# EAGLE design adrone_v0 (EAGLE 8.1.0)
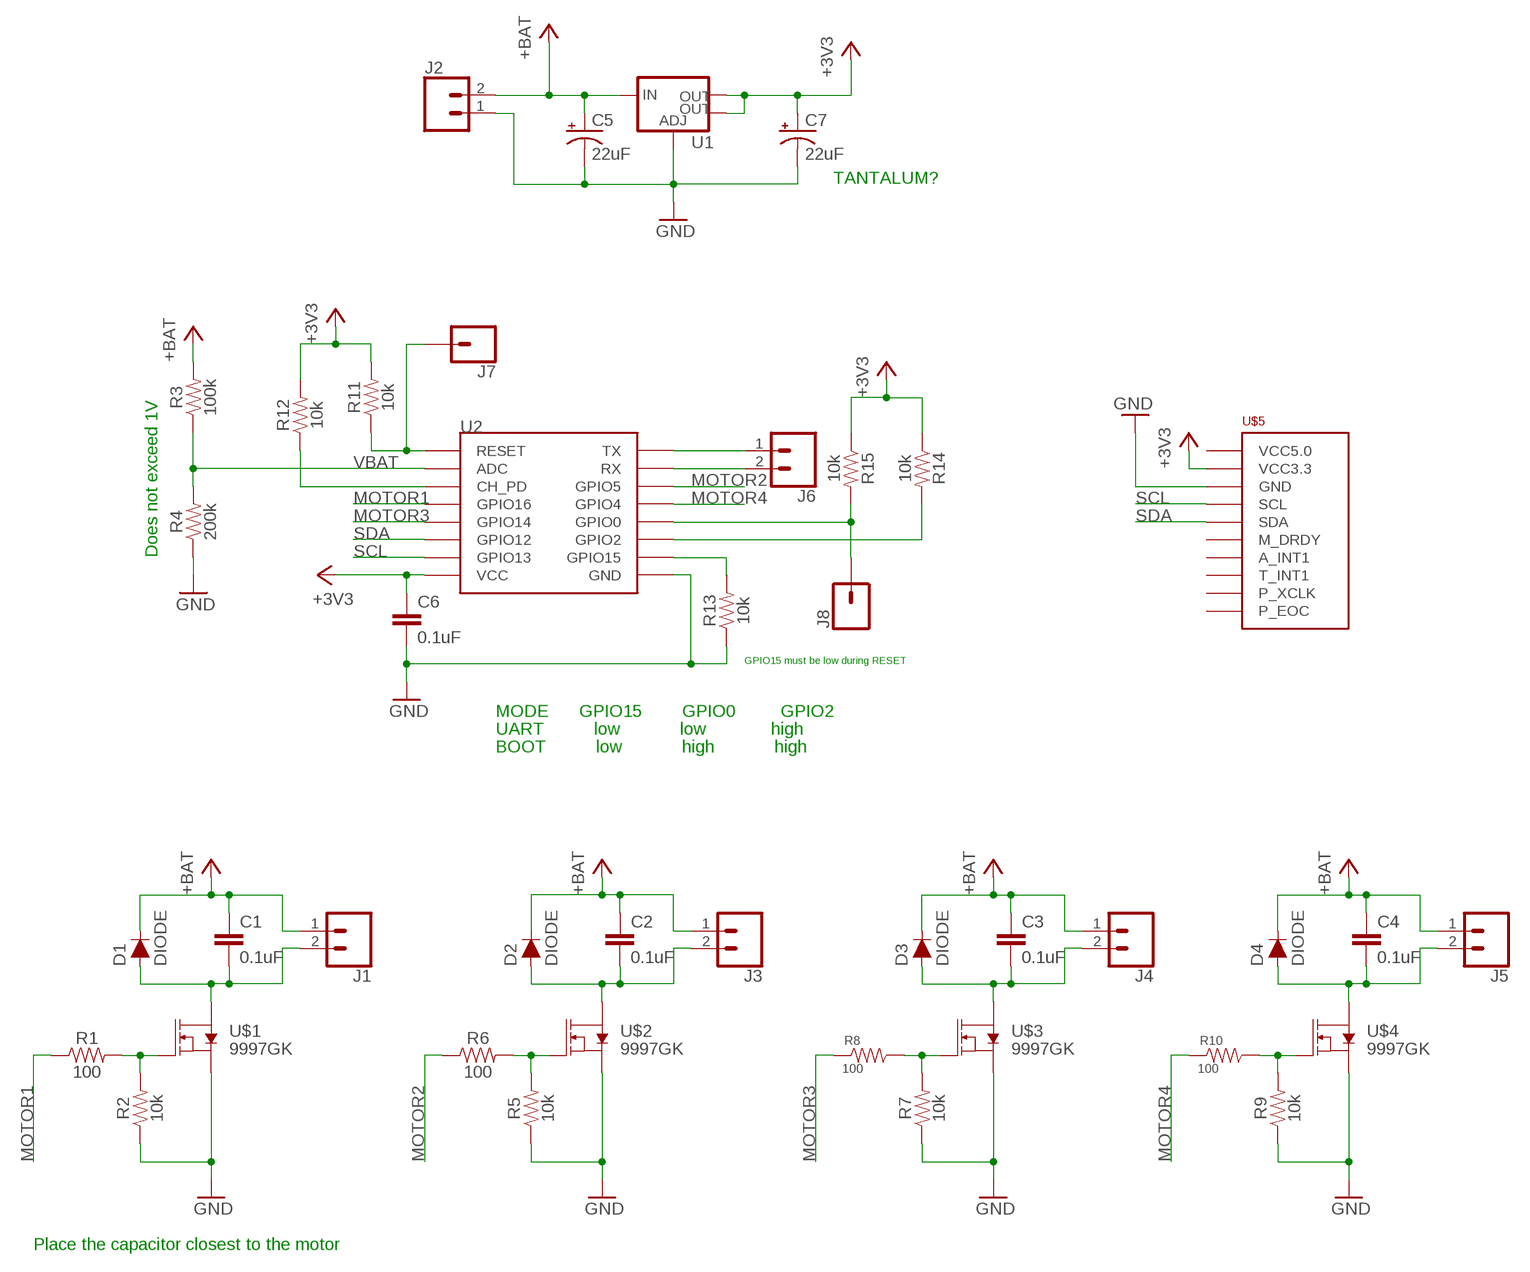
[diagram p0: schematic, sheet 1]

## Parts
C1  0.1uF  0.1UF-KIT-EZ-50V-20%  [CAP-PTH-SMALL-KIT]
C2  0.1uF  0.1UF-KIT-EZ-50V-20%  [CAP-PTH-SMALL-KIT]
C3  0.1uF  0.1UF-KIT-EZ-50V-20%  [CAP-PTH-SMALL-KIT]
C4  0.1uF  0.1UF-KIT-EZ-50V-20%  [CAP-PTH-SMALL-KIT]
C5  22uF  100UF-POLAR-RADIAL-2.5MM-25V-20%  [CPOL-RADIAL-2.5MM-6.5MM]
C6  0.1uF  0.1UF-KIT-EZ-50V-20%  [CAP-PTH-SMALL-KIT]
C7  22uF  100UF-POLAR-RADIAL-2.5MM-25V-20%  [CPOL-RADIAL-2.5MM-6.5MM]
D1  DIODE  [AXIAL-0.1]
D2  DIODE  [AXIAL-0.1]
D3  DIODE  [AXIAL-0.1]
D4  DIODE  [AXIAL-0.1]
J1  CONN_02  [1X02]
J2  CONN_02  [1X02]
J3  CONN_02  [1X02]
J4  CONN_02  [1X02]
J5  CONN_02  [1X02]
J6  CONN_02  [1X02]
J7  CONN_01  [1X01]
J8  CONN_01  [1X01]
R1  100  100OHM-HORIZ-1/4W-1%  [AXIAL-0.3]
R2  10k  10KOHM-HORIZ-1/6W-5%  [AXIAL-0.3]
R3  100k  100KOHM-HORIZ-1/4W-1%  [AXIAL-0.3]
R4  200k  100KOHM-HORIZ-1/4W-5%  [AXIAL-0.3]
R5  10k  10KOHM-HORIZ-1/6W-5%  [AXIAL-0.3]
R6  100  100OHM-HORIZ-1/4W-1%  [AXIAL-0.3]
R7  10k  10KOHM-HORIZ-1/6W-5%  [AXIAL-0.3]
R8  100  RES  [RES-2]
R9  10k  10KOHM-HORIZ-1/6W-5%  [AXIAL-0.3]
R10  100  RES  [RES-2]
R11  10k  10KOHM-HORIZ-1/4W-1%  [AXIAL-0.3]
R12  10k  10KOHM-HORIZ-1/4W-1%  [AXIAL-0.3]
R13  10k  10KOHM-VERT-1/4W-1%  [AXIAL-0.1]
R14  10k  10KOHM-HORIZ-1/4W-1%  [AXIAL-0.3]
R15  10k  10KOHM-HORIZ-1/4W-1%  [AXIAL-0.3]
U1  V_REG_LM1117SOT223  [SOT223]
U2  ESP12F  [ESP12F]
U$1  9997GK  [SOT223]
U$2  9997GK  [SOT223]
U$3  9997GK  [SOT223]
U$4  9997GK  [SOT223]
U$5  GY-80_10DOF  [GY-80_10DOF]

## Nets
+3V3: C6.1 C7.1(+) R11.P$2 R12.P$2 R14.P$1 R15.P$1 U1.2(OUT) U1.4(OUT) U2.VCC U$5.P$2(VCC3.3)
+BAT: C1.1 C2.1 C3.1 C4.1 C5.1(+) D1.C D2.C D3.C D4.C J1.1 J2.2 J3.1 J4.1 J5.1 R3.P$2 U1.3(IN)
ESP-RX: J6.2 U2.RX
ESP-TX: J6.1 U2.TX
GND: C5.2(-) C6.2 C7.2(-) J2.1 R2.P$1 R4.P$1 R5.P$1 R7.P$1 R9.P$1 R13.P$1 U1.1(ADJ) U2.GND U$1.3(S) U$2.3(S) U$3.3(S) U$4.3(S) U$5.P$3(GND)
MOTOR1: R1.P$1 U2.GPIO16
MOTOR2: R6.P$1 U2.GPIO5
MOTOR3: R8.P$1 U2.GPIO14
MOTOR4: R10.P$1 U2.GPIO4
N$1: R1.P$2 R2.P$2 U$1.1(G)
N$2: C1.2 D1.A J1.2 U$1.2(D) U$1.4(D)
N$3: R14.P$2 U2.GPIO2
N$5: R5.P$2 R6.P$2 U$2.1(G)
N$6: C2.2 D2.A J3.2 U$2.2(D) U$2.4(D)
N$8: J7.1 R11.P$1 U2.RESET
N$9: J8.1 R15.P$2 U2.GPIO0
N$10: R12.P$1 U2.CH_PD
N$12: R13.P$2 U2.GPIO15
N$14: R7.P$2 R8.P$2 U$3.1(G)
N$15: C3.2 D3.A J4.2 U$3.2(D) U$3.4(D)
N$16: R9.P$2 R10.P$2 U$4.1(G)
N$18: C4.2 D4.A J5.2 U$4.2(D) U$4.4(D)
SCL: U2.GPIO13 U$5.P$4(SCL)
SDA: U2.GPIO12 U$5.P$5(SDA)
VBAT: R3.P$1 R4.P$2 U2.ADC
Unconnected: U$5.P$1(VCC5.0) U$5.P$6(M_DRDY) U$5.P$7(A_INT1) U$5.P$8(T_INT1) U$5.P$9(P_XCLK) U$5.P$10(P_EOC)

## Notes on the sheet
- TANTALUM?
- Does not exceed 1V
- GPIO15 must be low during RESET
- MODE      GPIO15        GPIO0         GPIO2
- UART          low            low             high
- BOOT          low            high            high
- Place the capacitor closest to the motor

## Library data of the parts
C1-C4 C6 = SparkFun-Capacitors:0.1UF: 0.1µF ceramic capacitors A capacitor is a passive two-terminal electrical component used to store electrical energy temporarily in an electric field.; PROD_ID: CAP-08370
C5 C7 = SparkFun-Capacitors:100UF-POLAR: 100µF polarized capacitors A capacitor is a passive two-terminal electrical component used to store electrical energy temporarily in an electric field.; PROD_ID: CAP-08439; VALUE: 100uF
D1-D4 = SparkFun-DiscreteSemi:DIODE: Diode These are standard reverse protection diodes and small signal diodes. SparkFun Products: SparkFun SparkPunk Sound Kit <https://www.sparkfun.com/products/11177> SparkFun ESP8266 Thing <https://www.sparkfun.com/products/13231>
J1-J6 = SparkFun-Connectors:CONN_02: Multi connection point. Often used as Generic Header-pin footprint for 0.1 inch spaced/style header connections On any of the 0.1 inch spaced packages, you can populate with these: Break Away Headers - Straight <https://www.sparkfun.com/products/116> (PRT-00116) Break Away Male Headers - Right Angle <https://www.sparkfun.com/products/553> (PRT-00553) Female Headers <https://www.sparkfun.com/products/115> (PRT-00115) Break Away Headers - Machine Pin <https://www.sparkfun.com/products/117> (PRT-00117) Break Away Female Headers - Swiss Machine Pin <https://www.sparkfun.com/products/743> (PRT-00743) For SCREWTERMINALS and SPRING TERMINALS visit here: Screw Terimnals on SparkFun.com <https://www.sparkfun.com/search/results?term=Screw+Terminals> (5mm/3.5mm/2.54mm spacing) This device is also useful as a general connection point to wire up your design to another part of your project. Our various solder wires solder well into these plated through hole pads. Hook-Up Wire - Assortment (Stranded, 22 AWG) <https://www.sparkfun.com/products/11375> (PRT-11375) Hook-Up Wire - Assortment (Solid Core, 22 AWG) <https://www.sparkfun.com/products/11367> (PRT-11367) View the entire wire category on our website here <https://www.sparkfun.com/categories/141> Special notes: Molex polarized connector foot print use with: PRT-08233 with associated crimp pins and housings. 2.54_SCREWTERM for use with PRT-10571. 3.5mm Screw Terminal footprints for PRT-08084 5mm Screw Terminal footprints for use with PRT-08432
J7 J8 = SparkFun-Connectors:CONN_01: Single connection point. Often used as Generic Header-pin footprint for 0.1 inch spaced/style header connections On any of the 0.1 inch spaced packages, you can populate with these: Break Away Headers - Straight <https://www.sparkfun.com/products/116> (PRT-00116) Break Away Male Headers - Right Angle <https://www.sparkfun.com/products/553> (PRT-00553) Female Headers <https://www.sparkfun.com/products/115> (PRT-00115) Break Away Headers - Machine Pin <https://www.sparkfun.com/products/117> (PRT-00117) Break Away Female Headers - Swiss Machine Pin <https://www.sparkfun.com/products/743> (PRT-00743) This device is also useful as a general connection point to wire up your design to another part of your project. Our various solder wires solder well into these plated through hole pads. Hook-Up Wire - Assortment (Stranded, 22 AWG) <https://www.sparkfun.com/products/11375> (PRT-11375) Hook-Up Wire - Assortment (Solid Core, 22 AWG) <https://www.sparkfun.com/products/11367> (PRT-11367) View the entire wire category on our website here <https://www.sparkfun.com/categories/141> Special notes: SMTSO-256-ET is a "flush mount" nut for a 4-40 screw. We mostly use this on specialty testbeds; it is a nice way to connect hardware to your PCB at an adjustable hieght. Also note, the SNAP packages are for using a snappable style connector. We sell a baggie of snaps and they are also used on two LilyPad designs: Snap Assortment - 30 pack (male and female) <https://www.sparkfun.com/products/11347> (DEV-11347) LilyPad Arduino SimpleSnap <https://www.sparkfun.com/products/10941> (DEV-10941) LilyPad SimpleSnap Protoboard <https://www.sparkfun.com/products/10940> (DEV-10940)
R1 R6 = SparkFun-Resistors:100OHM: 100Ω resistor A resistor is a passive two-terminal electrical component that implements electrical resistance as a circuit element. Resistors act to reduce current flow, and, at the same time, act to lower voltage levels within circuits. - Wikipedia; PROD_ID: RES-12181
R2 R5 R7 R9 = SparkFun-Resistors:10KOHM: 10kΩ resistor A resistor is a passive two-terminal electrical component that implements electrical resistance as a circuit element. Resistors act to reduce current flow, and, at the same time, act to lower voltage levels within circuits. - Wikipedia; PROD_ID: RES-08375
R3 = SparkFun-Resistors:100KOHM: 100kΩ resistor A resistor is a passive two-terminal electrical component that implements electrical resistance as a circuit element. Resistors act to reduce current flow, and, at the same time, act to lower voltage levels within circuits. - Wikipedia; PROD_ID: RES-12184
R4 = SparkFun-Resistors:100KOHM: 100kΩ resistor A resistor is a passive two-terminal electrical component that implements electrical resistance as a circuit element. Resistors act to reduce current flow, and, at the same time, act to lower voltage levels within circuits. - Wikipedia; PROD_ID: RES-10686; VALUE: 100k
R8 R10 = 1AugustoLib:RES
R11-R15 = SparkFun-Resistors:10KOHM: 10kΩ resistor A resistor is a passive two-terminal electrical component that implements electrical resistance as a circuit element. Resistors act to reduce current flow, and, at the same time, act to lower voltage levels within circuits. - Wikipedia; PROD_ID: RES-12183
U1 = SparkFun-IC-Power:V_REG_LM1117: Voltage Regulator LM1117 Standard adjustable voltage regulator but in SMD form. Spark Fun Electronics SKU : COM-00595; PROD_ID: VREG-08170
U2 = esp8266modules:ESP12F: ESP8266 Wifi module 12
U$1-U$4 = SparkFun-DiscreteSemi:9997GK: http://www.image.micros.com.pl/_dane_techniczne_auto/tap9997gk-hf-3.pdf
U$5 = 1AugustoLib:GY-80_10DOF

## Board
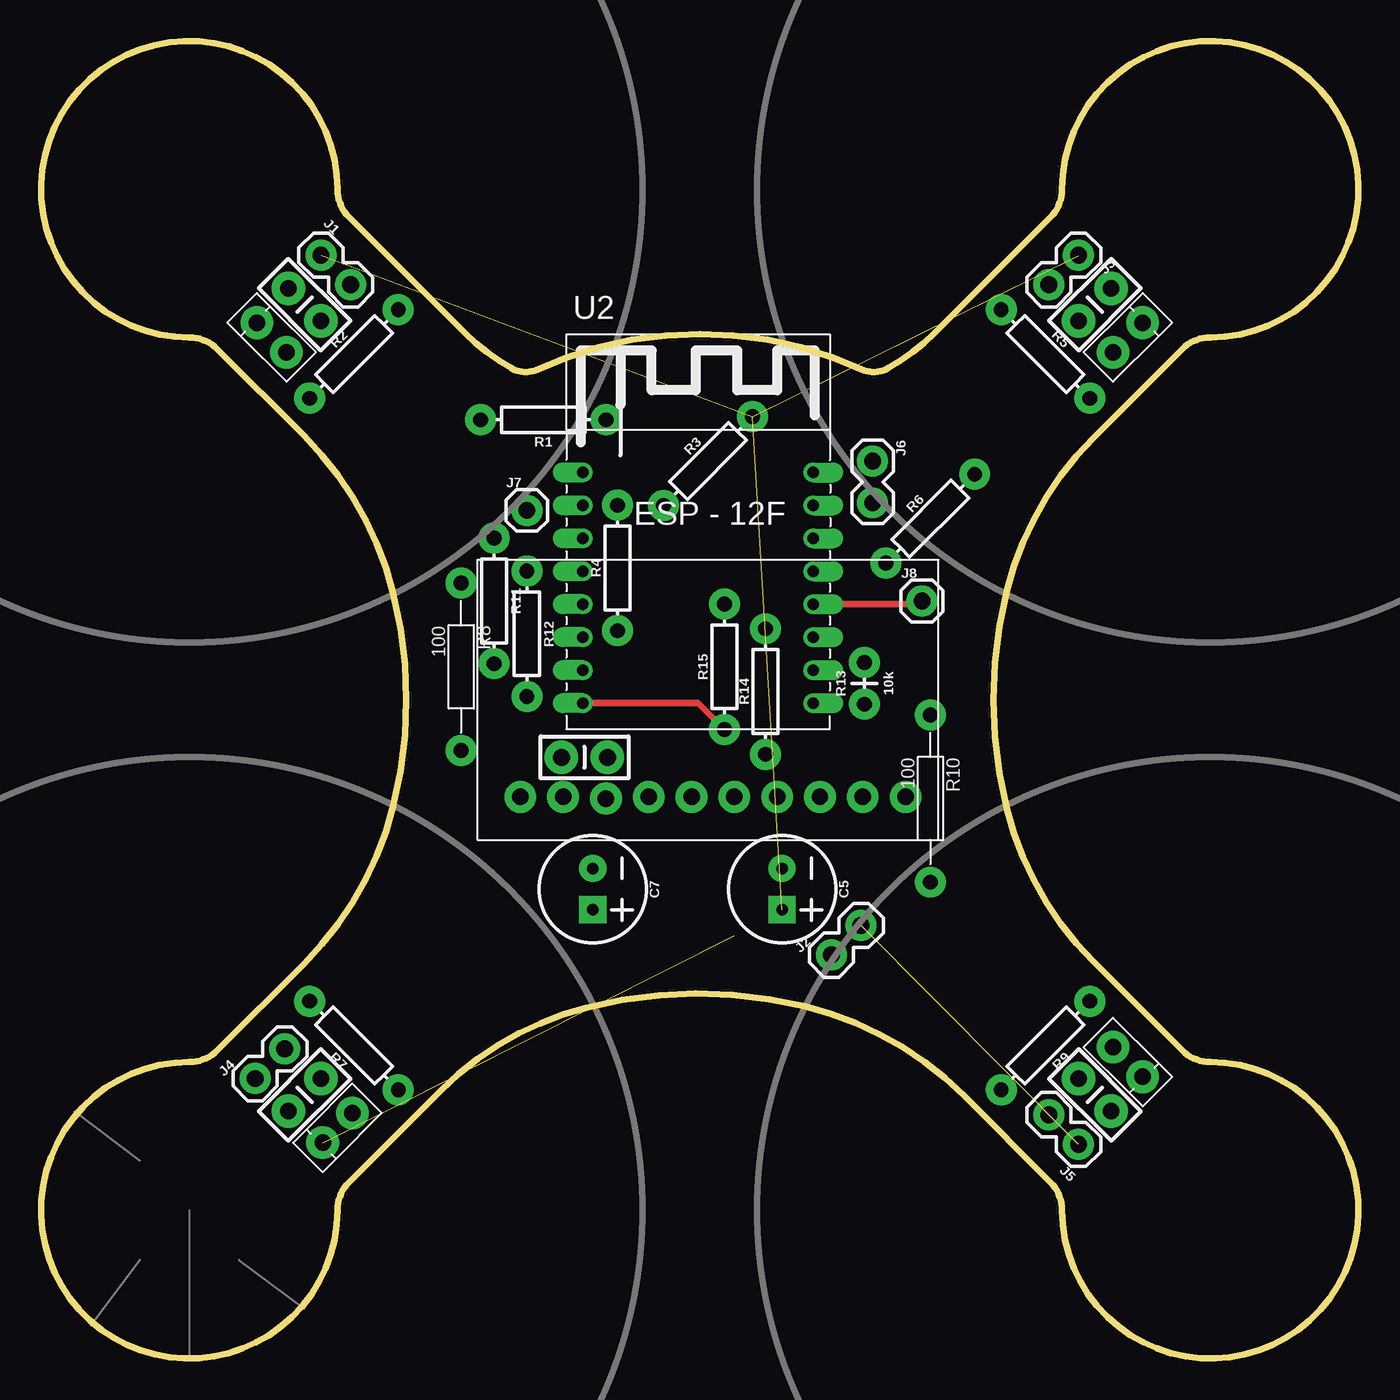
[diagram p1: board, top side]
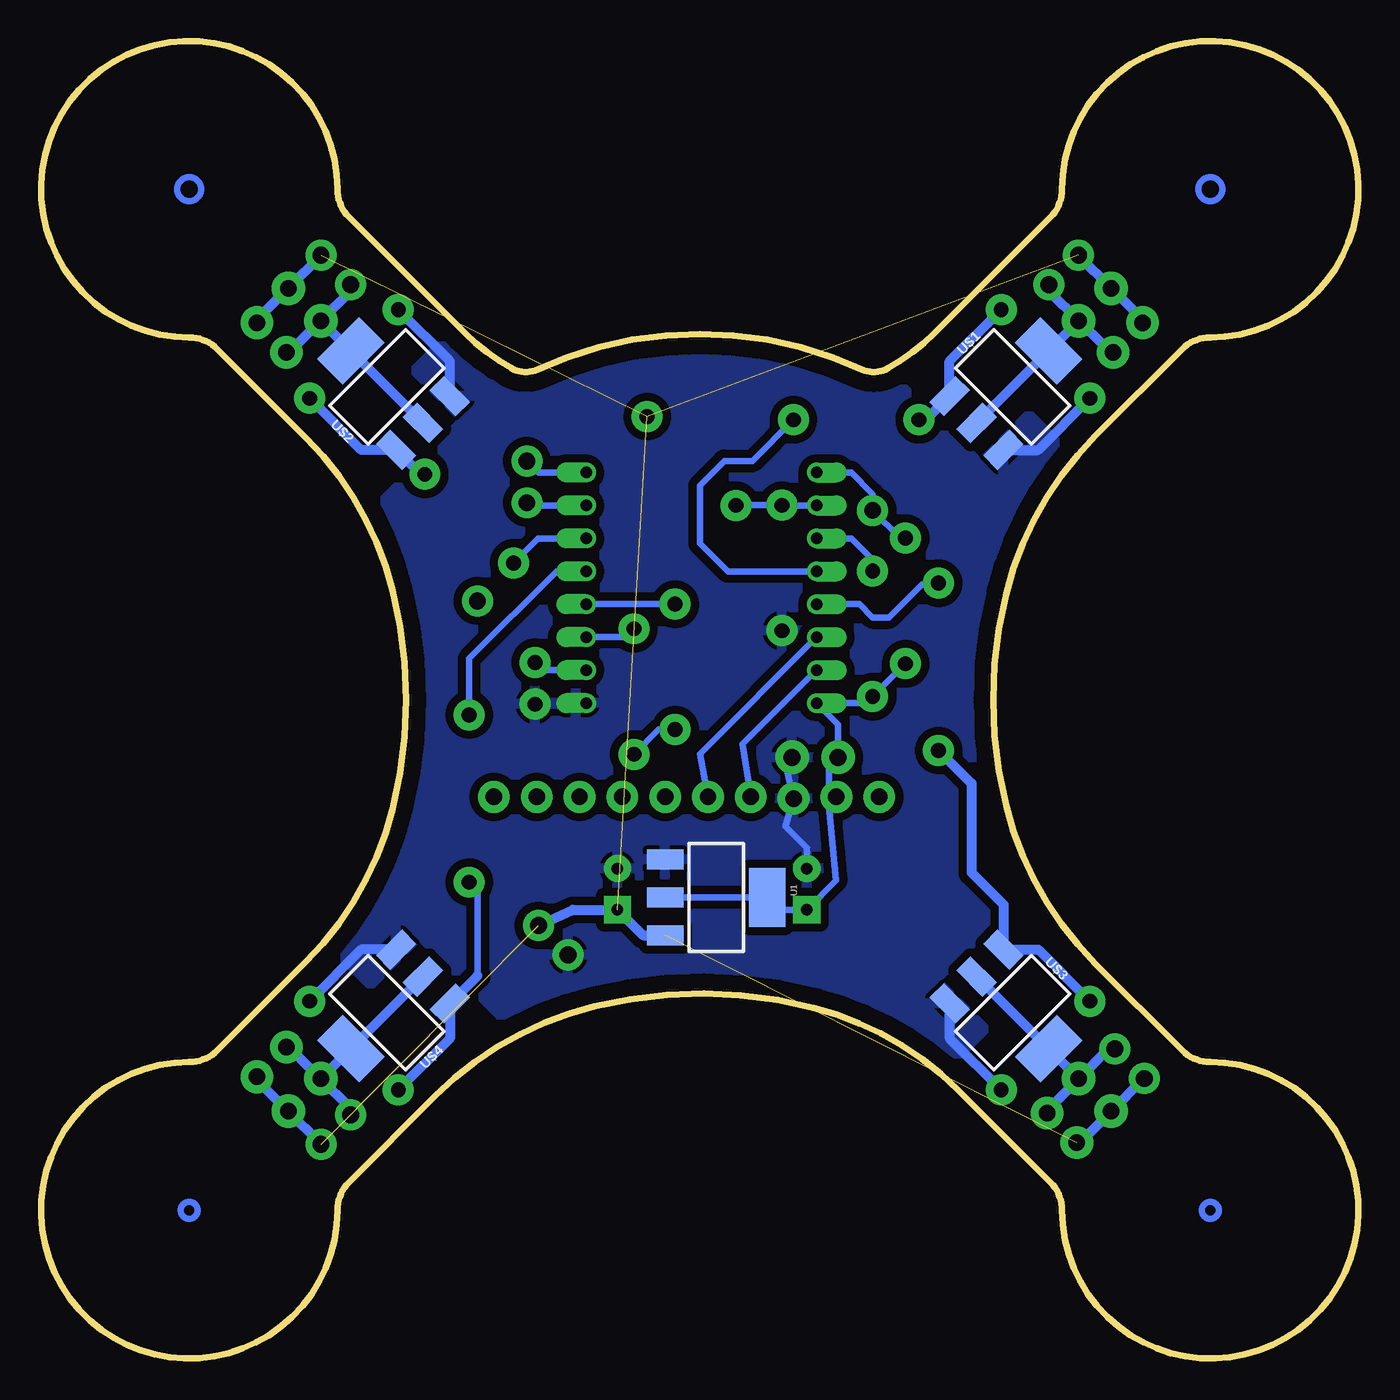
[diagram p2: board, bottom side, seen from below]

Size 79.99 x 79.99 mm. Coordinates in mm from the lower left corner, seen from the top.
Outline: 70.99,61.99 arc45 69.29,61.29 63.91,55.91 arc31 58.65,46.62 arc28 58.65,33.37 arc31 63.91,24.07 69.29,18.7 arc45 70.99,17.99 arc-270 61.99,8.99 arc45 61.29,10.7 56.05,15.94 arc31 46.42,21.36 arc28 33.08,21.29 arc31 24.28,16.28 18.7,10.7 arc45 17.99,8.99 arc-270 8.99,17.99 arc45 10.7,18.7 15.96,23.96 arc31 21.38,33.54 arc28 21.38,46.45 arc31 15.96,56.03 10.7,61.29 arc45 8.99,61.99 arc-270 17.99,70.99 arc45 18.7,69.29 25.73,62.26 arc16 28.55,60.13 arc47 29.99,59.99 arc-50 49.99,59.99 arc47 51.44,60.13 arc16 54.26,62.26 61.29,69.29 arc45 61.99,70.99 arc-270 70.99,61.99
Copper layers (1*16): Top 0.035mm / dielectric 1.5mm / Bottom 0.035mm
Design rules "default": minimum track width 10mil, minimum drill 24mil, track to track 8mil, track to pad 8mil, pad to pad 8mil, via to via 8mil, smd to smd 8mil, copper to edge 40mil, drill to drill 8mil, minimum pad ring 10mil, minimum via ring 8mil, stop-mask expansion 4mil, vias tented up to drill 0mil, thermal gap 10mil

### Footprints (pad centres in the part's own frame; a part is rotated, then mirrored left to right if it is on the bottom)
CAP-PTH-SMALL-KIT = drill 1.016 pad 2.032: 1 -1.397,0; 2 1.397,0
CPOL-RADIAL-2.5MM-6.5MM = drill 0.7 pad 1.651 square: 1 1.25,0 | drill 0.7 pad 1.651: 2 -1.25,0
AXIAL-0.1 = drill 1 pad 1.981: A -1.27,0; C 1.27,0
1X02 = drill 1.016 pad 1.88: 1 0,0; 2 2.54,0
1X01 = drill 1.016 pad 1.88: 1 0,0
AXIAL-0.3 = drill 0.9 pad 1.88: P$1 -3.81,0; P$2 3.81,0
RES-2 = drill 0.9 pad 1.88: P$1 -5.08,0; P$2 5.08,0
AXIAL-0.1' = drill 0.9 pad 1.88: P$1 -1.27,0; P$2 1.27,0
SOT223 = smd 1.219 x 2.235: 1 -2.311,-3.099; 2 0,-3.099; 3 2.311,-3.099 | smd 3.6 x 2.2: 4 0,3.099
ESP12F = drill 0.7 offset: ADC -7.1,3.8; CH_PD -7.1,1.8; GND 6.9,-8.2; GPIO0 6.9,-2.2; GPIO2 6.9,-4.2; GPIO4 6.9,-0.2; GPIO5 6.9,1.8; GPIO12 -7.1,-4.2; GPIO13 -7.1,-6.2; GPIO14 -7.1,-2.2; GPIO15 6.9,-6.2; GPIO16 -7.1,-0.2; RESET -7.1,5.8; RX 6.9,3.8; TX 6.9,5.8; VCC -7.1,-8.2
GY-80_10DOF = drill 1 pad 1.93: P$1 2.6,2.6; P$2 5.2,2.6; P$3 7.8,2.5; P$4 10.4,2.6; P$5 13,2.6; P$6 15.6,2.6; P$7 18.2,2.6; P$8 20.8,2.6; P$9 23.4,2.6; P$10 26,2.6

### Placement (x,y rotation side)
C1  15.99,63.99 315 top
C2  63.99,63.99 225 top
C3  15.99,15.99 45 top
C4  63.99,15.99 135 top
C5  44.99,28.49 270 top
C6  32.99,36.49 0 top
C7  33.49,28.49 270 top
D1  13.99,61.99 135 top
D2  65.99,61.99 45 top
D3  17.99,13.99 225 top
D4  65.99,17.99 315 top
J1  16.99,66.99 315 top
J2  47.99,24.49 45 top
J3  62.99,66.99 225 top
J4  12.99,16.99 45 top
J5  62.99,12.99 135 top
J6  50.49,54.49 270 top
J7  29.49,51.49 0 top
J8  53.49,45.99 0 top
R1  30.49,56.99 180 top
R2  18.99,60.99 45 top
R3  40.49,54.49 45 top
R4  34.99,47.99 90 top
R5  60.99,60.99 315 top
R6  53.99,50.99 45 top
R7  18.99,18.99 135 top
R8  25.49,41.99 270 top
R9  60.99,18.99 225 top
R10  53.99,33.99 270 top
R11  27.49,45.99 270 top
R12  29.49,43.99 270 top
R13  10k  [AXIAL-0.1']  49.99,40.99 90 top
R14  43.99,40.49 90 top
R15  41.49,41.99 90 top
U1  38.99,27.99 270 bottom
U2  39.99,47.99 0 top
U$1  20.99,58.99 315 bottom
U$2  58.99,58.99 45 bottom
U$3  20.99,20.99 225 bottom
U$4  58.99,20.99 135 bottom
U$5  26.49,31.49 0 top

### Tracks (layer width: path | path; a pad name or v marks a point on that pad's centre or on a via)
+3V3
  Top 0.406: R15.P$1 39.88,39.79 U2.VCC
  Bottom 0.406: R11.P$2 R12.P$2 29.88,39.79 U2.VCC 31.6,38.5 C6.1 32.14,35.95 32.14,33.53 | 32.14,33.53 31.71,29.02 C7.1 35.15,27.24 U1.4 U1.2 | 32.14,33.53 U$5.P$2 | R14.P$1 42.49,38.18 R15.P$1
+BAT  (5 unrouted)
  Bottom 0.61: D1.C 13.1,63.07 C1.1 16.99,66.97 J1.1 | D2.C 66.89,63.07 C2.1 62.99,66.97 J3.1 | J4.1 13.02,16.99 C3.1 16.92,13.1 D3.C | D4.C 66.89,16.92 C4.1 62.99,13.02 J5.1 | U1.3 43.43,25.68 C5.1 47.7,27.24 J2.2
ESP-RX
  Bottom 0.406: J6.2 50.33,51.79 U2.RX
ESP-TX
  Bottom 0.406: J6.1 49.79,53.79 U2.TX
GND
  Bottom 0.406: C6.2 34.79,36.09 U$5.P$3 34.79,32.29 33.49,30.99 C7.2
  Bottom 0.61: U$1.3 19.43,55.17 R2.P$1 | U$2.3 55.17,60.56 R5.P$1 | U$3.3 24.82,19.43 R7.P$1 | U$4.3 60.56,24.82 R9.P$1
  pour Bottom (isolate 0.5): -0.01,-0.01 79.99,-0.01 79.99,79.99 -0.01,79.99
MOTOR1
  Bottom 0.406: U2.GPIO16 38.29,47.79 39.99,49.49 39.99,52.99 38.49,54.49 36.8,54.49 R1.P$1
MOTOR2
  Bottom 0.406: U2.GPIO5 49.81,49.79 R6.P$1
MOTOR3
  Bottom 0.406: U2.GPIO14 30.29,45.79 29.49,44.99 28.49,44.99 26.49,46.99 25.57,46.99 R8.P$1
MOTOR4
  Bottom 0.406: U2.GPIO4 48.69,47.79 53.99,42.49 R10.P$1
N$1
  Bottom 0.61: R2.P$2 24.82,60.56 U$1.1 26.26,56.99 R1.P$2
N$2
  Bottom 0.61: J1.2 18.79,64.81 C1.2 | D1.A 15.07,61.1 C1.2 | 19.24,60.74 U$1.4 | 19.24,60.74 U$1.2 | C1.2 | C1.2 19.24,60.74
N$3
  Bottom 0.406: R14.P$2 44.5,43.79 U2.GPIO2
N$5
  Bottom 0.61: R5.P$2 60.56,55.17 U$2.1 56.96,53.69 R6.P$2
N$6
  Bottom 0.61: D2.A 64.92,61.1 C2.2 | J3.2 61.2,64.81 C2.2 | C2.2 | C2.2 U$2.4 U$2.2
N$8
  Bottom 0.406: R11.P$1 27.8,49.8 J7.1 29.49,52.49 30.79,53.79 U2.RESET
N$9
  Top 0.406: U2.GPIO0 53.29,45.79 J8.1
  Bottom 0.406: R15.P$2 U2.GPIO0
N$10
  Bottom 0.406: U2.CH_PD 30.79,49.79 29.49,48.49 R12.P$1
N$12
  Bottom 0.406: R13.P$2 49.52,41.79 U2.GPIO15
N$14
  Bottom 0.61: R7.P$2 19.43,24.82 U$3.1 21.55,27.55 23.49,29.49 23.49,34.91 R8.P$2
N$15
  Bottom 0.61: D3.A 18.89,15.07 C3.2 | J4.2 15.17,18.79 C3.2 | C3.2 | C3.2 U$3.4 U$3.2
N$16
  Bottom 0.406: R10.P$2 53.49,28.41 53.49,23.23
  Bottom 0.61: R9.P$2 55.17,19.43 U$4.1 53.49,23.23
N$18
  Bottom 0.61: J5.2 61.2,15.17 C4.2 | D4.A 64.92,18.89 C4.2 | C4.2 | C4.2 U$4.4 U$4.2
N$19
  cutout Bottom: 57.99,23.99 59.99,21.99 62.99,24.99 65.99,21.99 57.99,13.99 51.99,19.99 56.99,24.99
  cutout Bottom: 23.99,21.99 21.99,19.99 24.99,16.99 21.99,13.99 13.99,21.99 19.99,27.99 24.99,22.99
  cutout Bottom: 55.99,57.99 57.99,59.99 54.99,62.99 57.99,65.99 65.99,57.99 59.99,51.99 54.99,56.99
  cutout Bottom: 21.99,55.99 19.99,57.99 16.99,54.99 13.99,57.99 21.99,65.99 27.99,59.99 22.99,54.99
SCL
  Bottom 0.406: U2.GPIO13 37.39,37.29 U$5.P$4
SDA
  Bottom 0.406: U2.GPIO12 39.99,36.69 U$5.P$5
VBAT
  Bottom 0.406: U2.ADC R4.P$2 R3.P$1
(copper drawn outside any net)
  shapes: Bottom circle x4